# Altium schematic sheet CoG_SRV.SchDoc
size A4; Author: Audran; CompanyName: Goldorak; Address1: Electrolab; Address2: 52 rue Paul Lescop; Address3: 92000 Nanterre; ProjectName: Cartes_2017
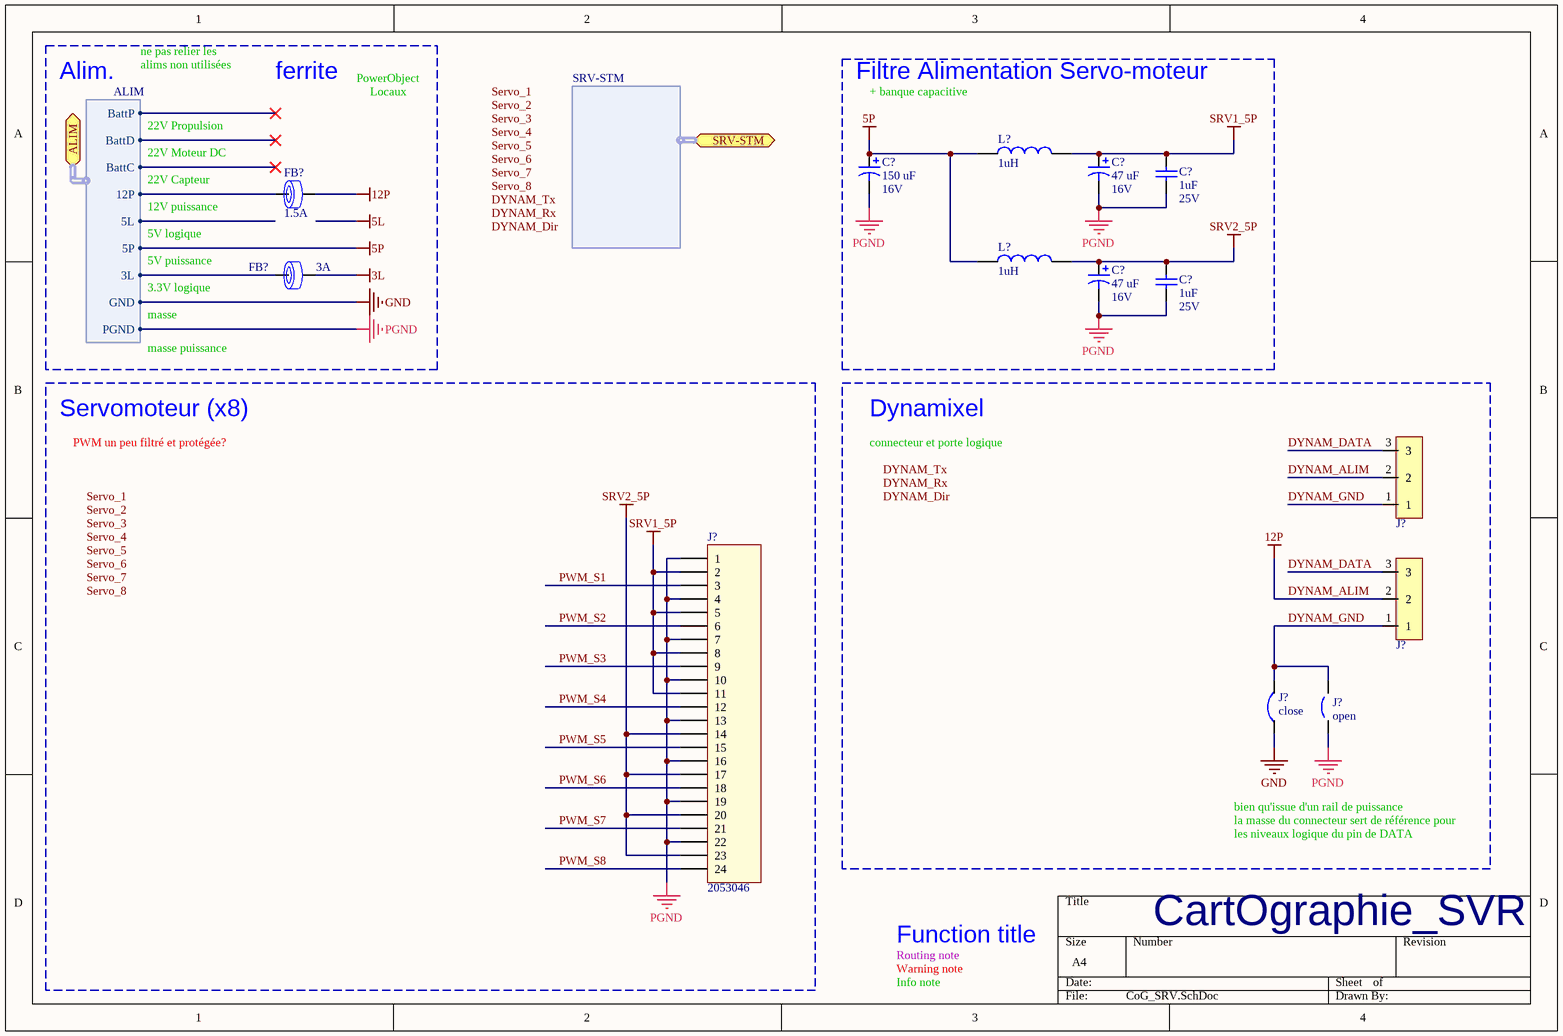
[diagram p0: CoG_SRV.SchDoc]

## Parts
(Parts that share a designator on the sheet are numbered #1, #2 ... from top to bottom, then left to right.)
C?#1  150 uF  RatedVoltage: 16V  [WCAP-ATG8_6.3x11x2.5x0.5]
C?#2  47 uF  RatedVoltage: 16V  [WCAP-ATG8_5x11x2x0.5]
C?#3  1uF  RatedVoltage: 25V  [WCAP-CSGP_0603, 1.6x0.8x0.8]
C?#4  47 uF  RatedVoltage: 16V  [WCAP-ATG8_5x11x2x0.5]
C?#5  1uF  RatedVoltage: 25V  [WCAP-CSGP_0603, 1.6x0.8x0.8]
FB?#1  RatedCurrent: 1.5A  [WE-CBF_0603_High Current]  (hidden comment: 742792624)
FB?#2  RatedCurrent: 3A  [WE-CBF_0805_High Current]  (hidden comment: 742792023)
J?#1  22-03-5035  [20-03-5035]  (value not drawn)
J?#2  22-03-5035  [20-03-5035]  (value not drawn)
J?#3  Supplier Part Number 1: 2053046  [TSW-108-08-F-T-RA]  (hidden comment: TSW-108-08-F-T-RA)
J?#4  close  [CAVALIER_0603_C]  (no BOM)
J?#5  open  [CAVALIER_0603_O]  (no BOM)
L?#1  value 1uH  [WE-PD2_4532]  (hidden comment: WE-PD2, 7447730)
L?#2  value 1uH  [WE-PD2_4532]  (hidden comment: WE-PD2, 7447730)

## Blocks framed on the sheet
Filtre Alimentation Servo-moteur: C?#1-C?#5 L?#1 L?#2
Servomoteur (x8): J?#3
Dynamixel: J?#1 J?#2 J?#4 J?#5

## Ports
ALIM (harness ALIM), SRV-STM (harness SRV-STM)

## Harnesses
SRV-STM: 
ALIM: BattP, BattD, BattC, 12P, 5L, 5P, 3L, GND, PGND

## Nets
3L: FB?#2.2
5P: C?#1.1 L?#1.1 L?#2.1 ; port ALIM.5P
DYNAM_ALIM: FB?#1.2 J?#1.2 J?#2.2  [also labelled 12P]
GND: J?#4.1 ; port ALIM.GND
PGND: C?#1.2 C?#2.2 C?#3.1 C?#4.2 C?#5.1 J?#3.1 J?#3.4 J?#3.7 J?#3.10 J?#3.13 J?#3.16 J?#3.19 J?#3.22 J?#5.1 ; port ALIM.PGND
SRV1_5P: C?#2.1 C?#3.2 J?#3.2 J?#3.5 J?#3.8 J?#3.11 L?#1.2
SRV2_5P: C?#4.1 C?#5.2 J?#3.14 J?#3.17 J?#3.20 J?#3.23 L?#2.2
DYNAM_DATA: J?#1.3 J?#2.3
DYNAM_GND: J?#1.1 J?#2.1 J?#4.2 J?#5.2
PWM_S1: J?#3.3
PWM_S2: J?#3.6
PWM_S3: J?#3.9
PWM_S4: J?#3.12
PWM_S5: J?#3.15
PWM_S6: J?#3.18
PWM_S7: J?#3.21
PWM_S8: J?#3.24
NetFB?#1_1: FB?#1.1 ; port ALIM.12P
NetFB?#2_1: FB?#2.1 ; port ALIM.3L

## Notes on the sheet
- Alim.
- ne pas relier les
- alims non utilisées
- ferrite
- PowerObject
- Locaux
- + banque capacitive
- 22V Propulsion
- 22V Moteur DC
- 5V logique
- 12V puissance
- 22V Capteur
- 5V puissance
- 3.3V logique
- masse
- masse puissance
- PWM un peu filtré et protégée?
- connecteur et porte logique
- bien qu'issue d'un rail de puissance
- la masse du connecteur sert de référence pour
- les niveaux logique du pin de DATA
- Routing note
- Warning note
- Info note
- Function title
- CartOgraphie_SVR
- Labels drawn without touching a wire or pin: DYNAM_Dir, DYNAM_Rx, DYNAM_Tx, Servo_1, Servo_2, Servo_3, Servo_4, Servo_5, Servo_6, Servo_7, Servo_8

## Library data of the parts
C?#1 = WCAP-ATG8, 860010373008: CAP Alu 150 UF 20% 16 V; Manufacturer: Wurth Elektronik; PublishedDate: July 2016; ComponentLink1Description: Manufacturer; ComponentLink1URL: http://www.we-online.de; ComponentLink2Description: Datasheet; ComponentLink2URL: http://katalog.we-online.de/pbs/datasheet/860010373008.pdf; Manufacturer Part Number: 860010373008; Value: 150 uF; Size: 6.3mmx11mm
C?#2 C?#4 = WCAP-ATG8, 860010372004: CAP Alu 47 UF 20% 16 V; Manufacturer: Wurth Elektronik; PublishedDate: July 2016; ComponentLink1Description: Manufacturer; ComponentLink1URL: http://www.we-online.de; ComponentLink2Description: Datasheet; ComponentLink2URL: http://katalog.we-online.de/pbs/datasheet/860010372004.pdf; Manufacturer Part Number: 860010372004; Value: 47 uF; Size: 5mmx11mm
C?#3 C?#5 = WCAP-CSGP, 885012206076: CAP CER 1uF 25V X7R 0603; Manufacturer: Wurth Elektronik; PublishedDate: Aug 2016; ComponentLink1Description: Manufacturer; ComponentLink1URL: http://www.we-online.de; ComponentLink2Description: Datasheet; ComponentLink2URL: http://katalog.we-online.com/pbs/datasheet/885012206076.pdf; Manufacturer Part Number: 885012206076; Value: 1uF; Size: 0603; CeramicType: X7R
FB?#1 = WE-CBF, 742792624: Ferrite Bead 180ohm 0603 max1.5A; Manufacturer: Wurth Elektronik; Value: 180Ω; Type: High Current; PublishedDate: Aug 2016; ComponentLink1Description: Manufacturer; ComponentLink1URL: http://www.we-online.de; ComponentLink2Description: Datasheet; ComponentLink2URL: http://katalog.we-online.de/pbs/datasheet/742792624.pdf; Manufacturer Part Number: 742792624; Size: 0603
FB?#2 = WE-CBF, 742792023: Ferrite Bead 120ohm 0805 max3.0A; Manufacturer: Wurth Elektronik; Value: 120Ω; Type: High Current; PublishedDate: Aug 2016; ComponentLink1Description: Manufacturer; ComponentLink1URL: http://www.we-online.de; ComponentLink2Description: Datasheet; ComponentLink2URL: http://katalog.we-online.de/pbs/datasheet/742792023.pdf; Manufacturer Part Number: 742792023; Size: 0805
J?#1 J?#2 = 20-03-5035: Manufacturer 1: MOLEX; Supplier 1: Farnell; Supplier Part Number 1: 9979620; Manufacturer Part Number: 22-03-5035; Pricing: 10=0.153, 100=0.144, 250=0.118, 500=0.091, 1000=0.059, 2500=0.057, 2500=0.0441, 30000=0.0397 (EUR); ComponentLink1URL: http://www.farnell.com/cad/495071.pdf; ComponentLink1Description: http://www.farnell.com/cad/495071.pdf; ComponentLink2URL: http://www.farnell.com/datasheets/1801024.pdf; ComponentLink2Description: http://www.farnell.com/datasheets/1801024.pdf; ComponentLink3Description: http://fr.farnell.com/jsp/level5/module.jsp?moduleId=fr/418942.xml; ComponentLink3URL: http://fr.farnell.com/jsp/level5/module.jsp?moduleId=fr/418942.xml
J?#3 = TSW-108-08-F-T-RA: samtec 3x8 : TSW-108-08-F-T-RA; Manufacturer Part Number: TSW-104-08-F-T-RA; Manufacturer 1: SAMTEC; ComponentLink2URL: http://cloud.samtec.com/catalog_english/TSW_TH.PDF; ComponentLink2Description: http://cloud.samtec.com/catalog_english/TSW_TH.PDF; Supplier 1: Farnell
J?#4 = CAVALIER_0603_C: Cavalier soudure "fermé" + empreinte dipole 0603
J?#5 = CAVALIER_0603_O: Cavalier soudure "ouvert" + empreinte dipole 0603
L?#1 L?#2 = WE-PD2, 7447730: FIXED IND 1UH 4A 49 MOHM SMD; PublishedDate: Sep. 2016; Publisher: Wurth Elektronik; ComponentLink1Description: Manufacturer; ComponentLink1URL: http://www.we-online.de; ComponentLink2Description: Datasheet; ComponentLink2URL: http://katalog.we-online.de/pbs/datasheet/7447730.pdf; PartNumber: 7447730; Size: 4532